# Altium schematic sheet Capstone_Preconditioning_SchematicSheet.SchDoc
size C
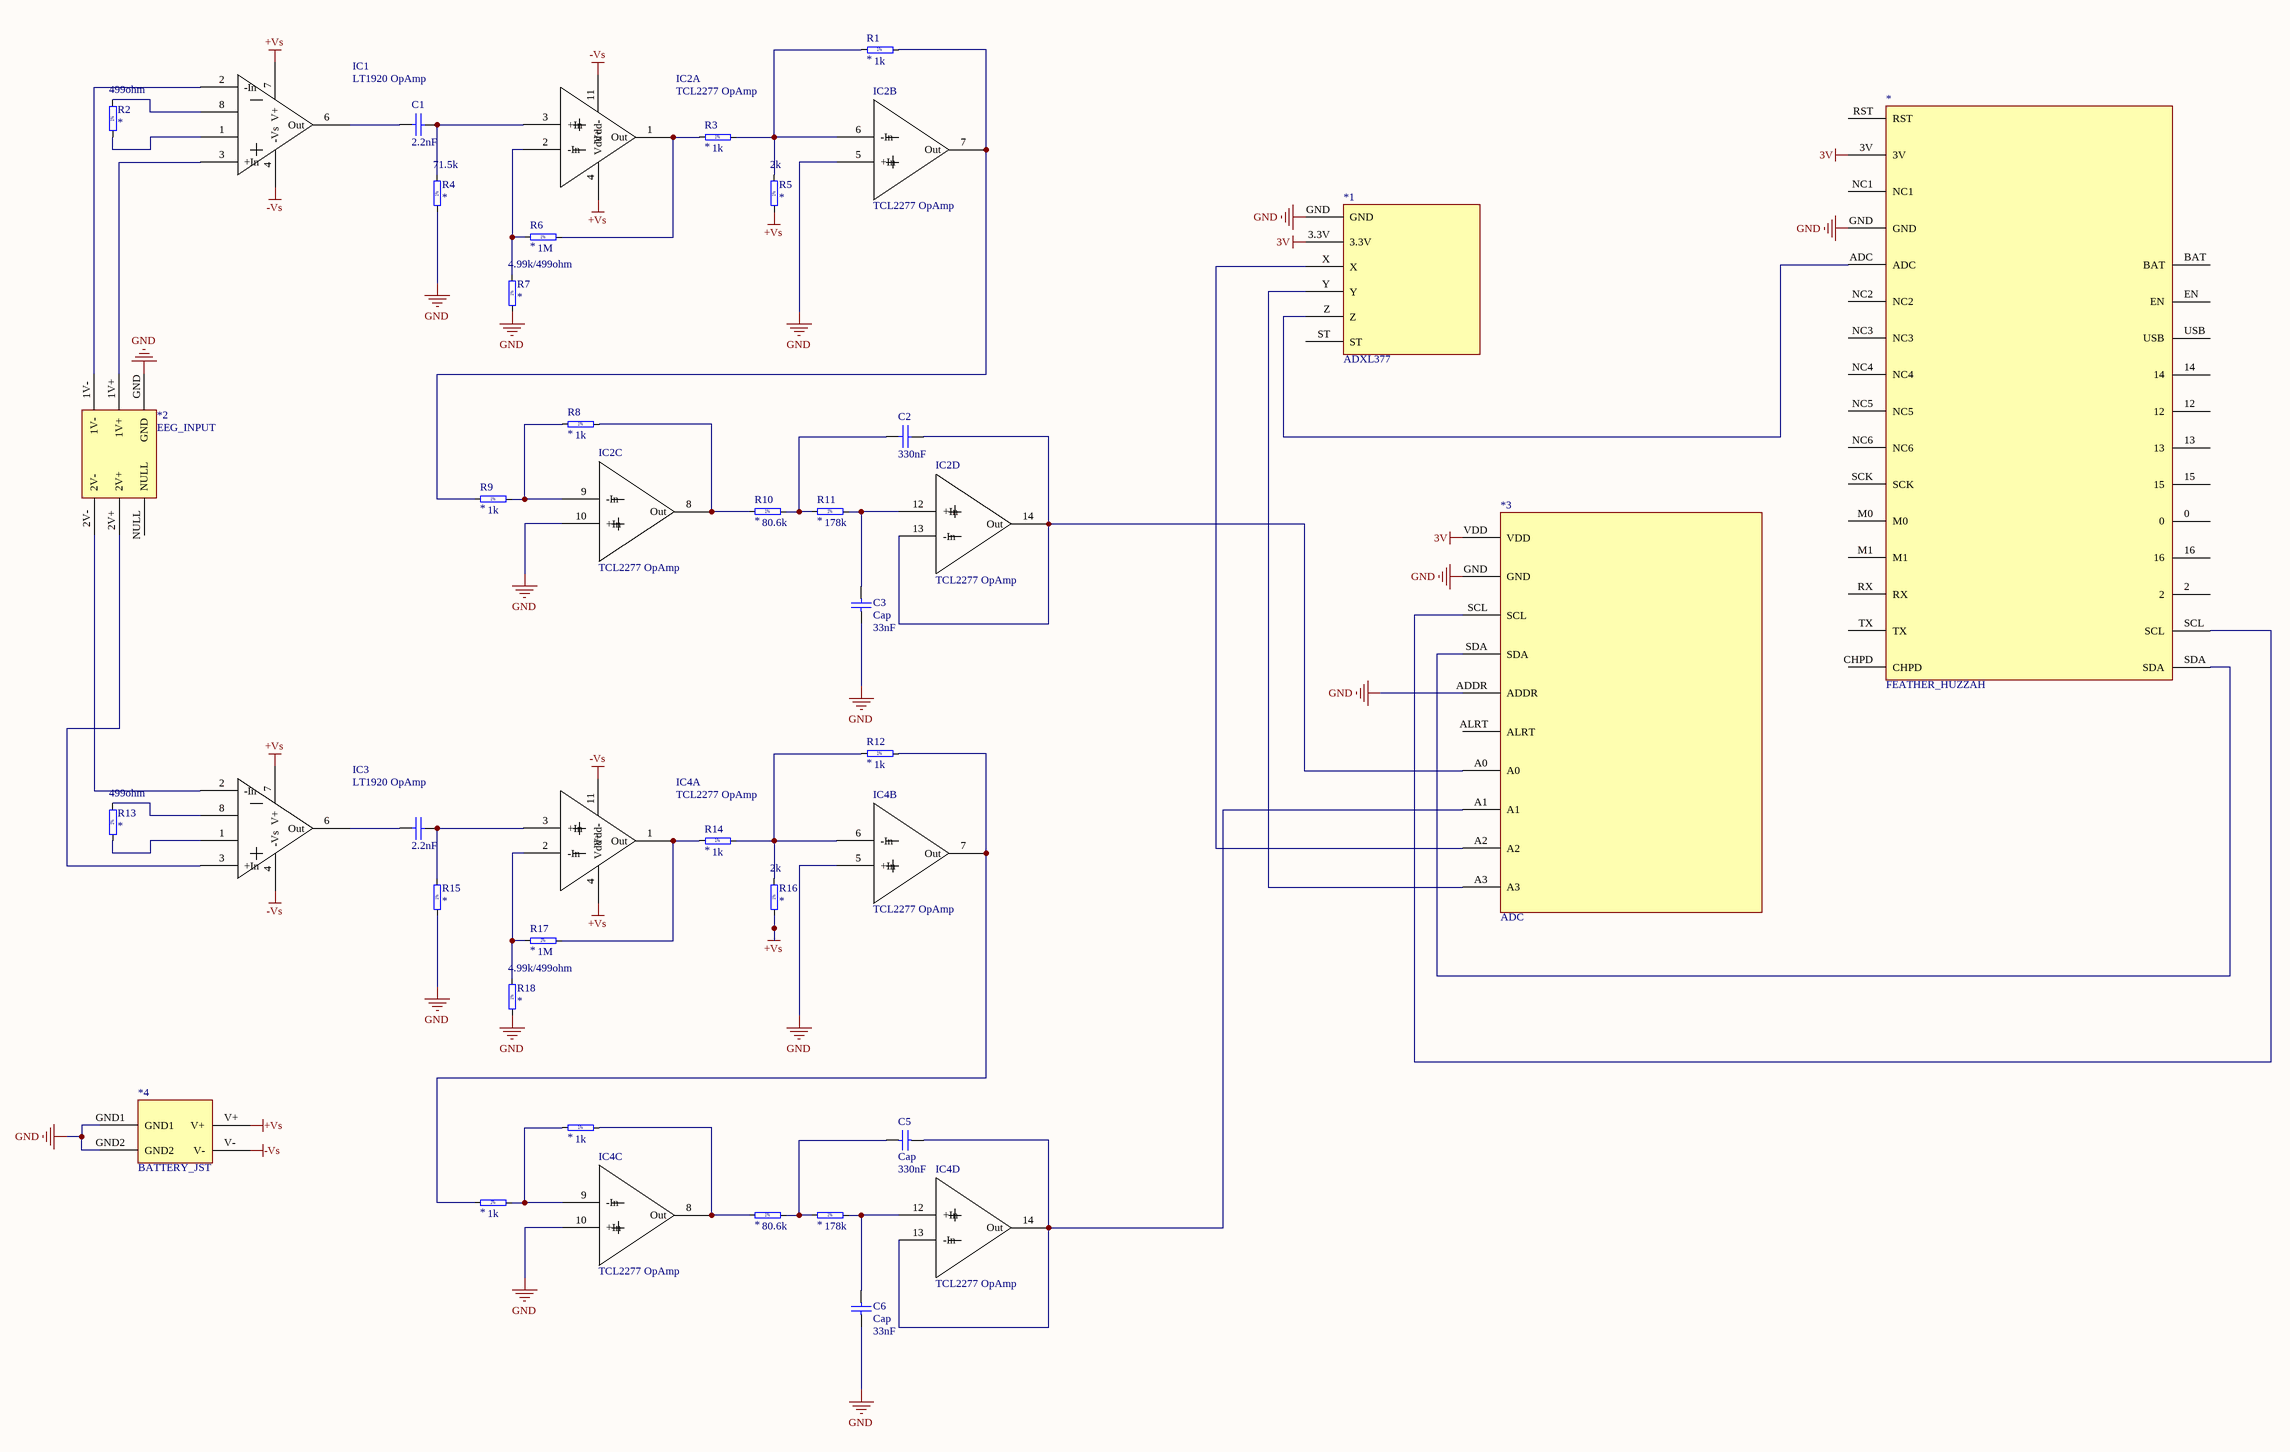
[diagram p0: Capstone_Preconditioning_SchematicSheet.SchDoc]

## Parts
*  FEATHER_HUZZAH  [Feather_Huzzah]
*1  ADXL377  [ADXL377_Acc]
*2  EEG_INPUT  [EEG_INPUT]
*3  ADC  [ADC]
*4  BATTERY_JST  [BATTERY_JST]
C1  2.2nF  [CAP_0603]
C2  330nF  [CAP_0603]
C3  Cap  value 33nF  [CAP_0603]
C4  2.2nF  [CAP_0603]
C5  Cap  value 330nF  [CAP_0603]
C6  Cap  value 33nF  [CAP_0603]
IC1  LT1920 OpAmp  [LT1920]
IC2  TCL2277 OpAmp  [TLC2277]  (parts A,B,C,D of 4)
IC3  LT1920 OpAmp  [LT1920]
IC4  TCL2277 OpAmp  [TLC2277]  (parts A,B,C,D of 4)
R1  1k  [RES_0603]
R2  499ohm  [RES_0603]
R3  1k  [RES_0603]
R4  71.5k  [RES_0603]
R5  2k  [RES_0603]
R6  1M  [RES_0603]
R7  4.99k/499ohm  [RES_0603]
R8  1k  [RES_0603]
R9  1k  [RES_0603]
R10  80.6k  [RES_0603]
R11  178k  [RES_0603]
R12  1k  [RES_0603]
R13  499ohm  [RES_0603]
R14  1k  [RES_0603]
R15  71.5k  [RES_0603]  (value not drawn)
R16  2k  [RES_0603]
R17  1M  [RES_0603]
R18  4.99k/499ohm  [RES_0603]
R19  1k  [RES_0603]
R20  1k  [RES_0603]
R21  80.6k  [RES_0603]
R22  178k  [RES_0603]

## Nets
3V: *.3V *1.3.3V *3.VDD
+Vs: *4.V+ IC1.7(V+) IC2.4(Vdd+) IC3.7(V+) IC4.4(Vdd+) R5.1 R16.1
-Vs: *4.V- IC1.4(-Vs) IC2.11(Vdd-) IC3.4(-Vs) IC4.11(Vdd-)
GND: *.GND *1.GND *2.GND *3.ADDR *3.GND *4.GND1 *4.GND2 C3.1 C6.1 IC2.5(+In) IC2.10(+In) IC4.5(+In) IC4.10(+In) R4.1 R7.1 R15.1 R18.1
Net*1_X: *1.X *3.A2
Net*1_Y: *1.Y *3.A3
Net*2_1V+: *2.1V+ IC1.3(+In)
Net*2_1V-: *2.1V- IC1.2(-In)
Net*2_2V+: *2.2V+ IC3.3(+In)
Net*2_2V-: *2.2V- IC3.2(-In)
Net*3_A0: *3.A0 C2.1 IC2.13(-In) IC2.14(Out)
Net*3_A1: *3.A1 C5.1 IC4.13(-In) IC4.14(Out)
Net*_ADC: *.ADC *1.Z
Net*_SCL: *.SCL *3.SCL
Net*_SDA: *.SDA *3.SDA
NetC1_1: C1.1 IC1.6(Out)
NetC1_2: C1.2 IC2.3(+In) R4.2
NetC2_2: C2.2 R10.2 R11.1
NetC3_2: C3.2 IC2.12(+In) R11.2
NetC4_1: C4.1 IC3.6(Out)
NetC4_2: C4.2 IC4.3(+In) R15.2
NetC5_2: C5.2 R21.2 R22.1
NetC6_2: C6.2 IC4.12(+In) R22.2
NetIC1_1: IC1.1(Rg) R2.1
NetIC1_8: IC1.8(Rg) R2.2
NetIC2_1: IC2.1(Out) R3.1 R6.2
NetIC2_2: IC2.2(-In) R6.1 R7.2
NetIC2_6: IC2.6(-In) R1.1 R3.2 R5.2
NetIC2_7: IC2.7(Out) R1.2 R9.1
NetIC2_8: IC2.8(Out) R8.2 R10.1
NetIC2_9: IC2.9(-In) R8.1 R9.2
NetIC3_1: IC3.1(Rg) R13.1
NetIC3_8: IC3.8(Rg) R13.2
NetIC4_1: IC4.1(Out) R14.1 R17.2
NetIC4_2: IC4.2(-In) R17.1 R18.2
NetIC4_6: IC4.6(-In) R12.1 R14.2 R16.2
NetIC4_7: IC4.7(Out) R12.2 R20.1
NetIC4_8: IC4.8(Out) R19.2 R21.1
NetIC4_9: IC4.9(-In) R19.1 R20.2

Not connected (* = marked no-connect by the designer): * 0 2 12 13 14 15 16 BAT CHPD EN M0 M1 NC1 NC2 NC3 NC4 NC5 NC6 RST RX SCK TX USB; *1 ST; *2 NULL; *3 ALRT

## Notes on the sheet
- (in symbol RES SEMI (1.0%)) 1%

## Library data of the parts
C1 C2 C4 = CAP SEMI MLCC: value: *
C3 C5 C6 = Cap: Capacitor; Published: 8-Jun-2000; LatestRevisionDate: 17-Jul-2002; LatestRevisionNote: Re-released for DXP Platform.; PackageReference: RAD-0.3; Publisher: Altium Limited; PackageDescription: Radial Cap, Thru-Hole; 2 Leads; 0.3 in Pin Spacing
IC2 IC4 = TCL2277
R1-R22 = RES SEMI (1.0%): 1.0%; value: *